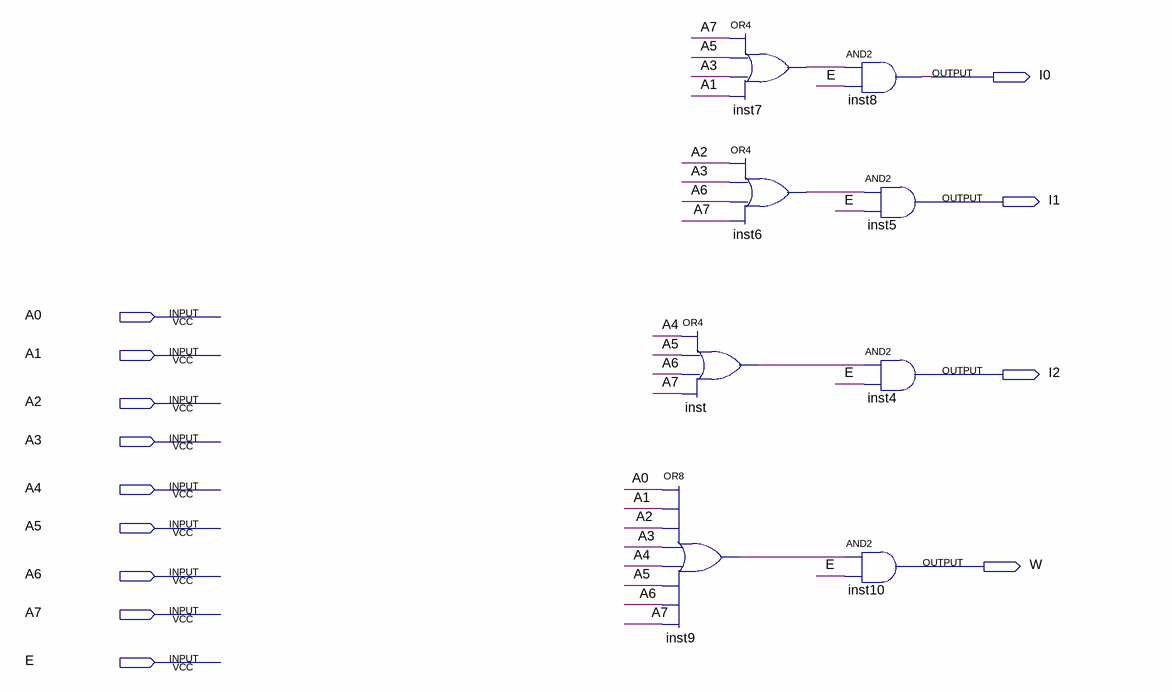
[diagram p0: schematic sheet]
// Quartus schematic CD8TO3.bdf as structural Verilog: 8 symbols, 13 pins
module CD8TO3 (
  input  A0,
  input  A1,
  input  A2,
  input  A3,
  input  A4,
  input  A5,
  input  A6,
  input  A7,
  input  E,
  output I0,
  output I1,
  output I2,
  output W
);

  wire inst6_out, inst7_out, inst9_out, inst_out;

  or inst7 (inst7_out, A7, A5, A3, A1);
  or inst6 (inst6_out, A2, A3, A6, A7);
  or inst (inst_out, A4, A5, A6, A7);
  or inst9 (inst9_out, A0, A1, A2, A3, A4, A5, A6, A7);
  and inst8 (I0, inst7_out, E);
  and inst5 (I1, inst6_out, E);
  and inst4 (I2, inst_out, E);
  and inst10 (W, inst9_out, E);
endmodule
